# EasyEDA Pro project ProPrj_大功率电调_2026-08-17.epro, schematic 主控板

## Sheets
1 主控STM: Assembly Variant: Basic; Board Name: Board1; Create Date: 2026-08-04; Page Name: P1; Project Name: 大功率电调; Schematic Name: Schematic1; Update Date: 2026-08-04; Company: 嘉立创EDA; Page Size: A4; Version: V1.0
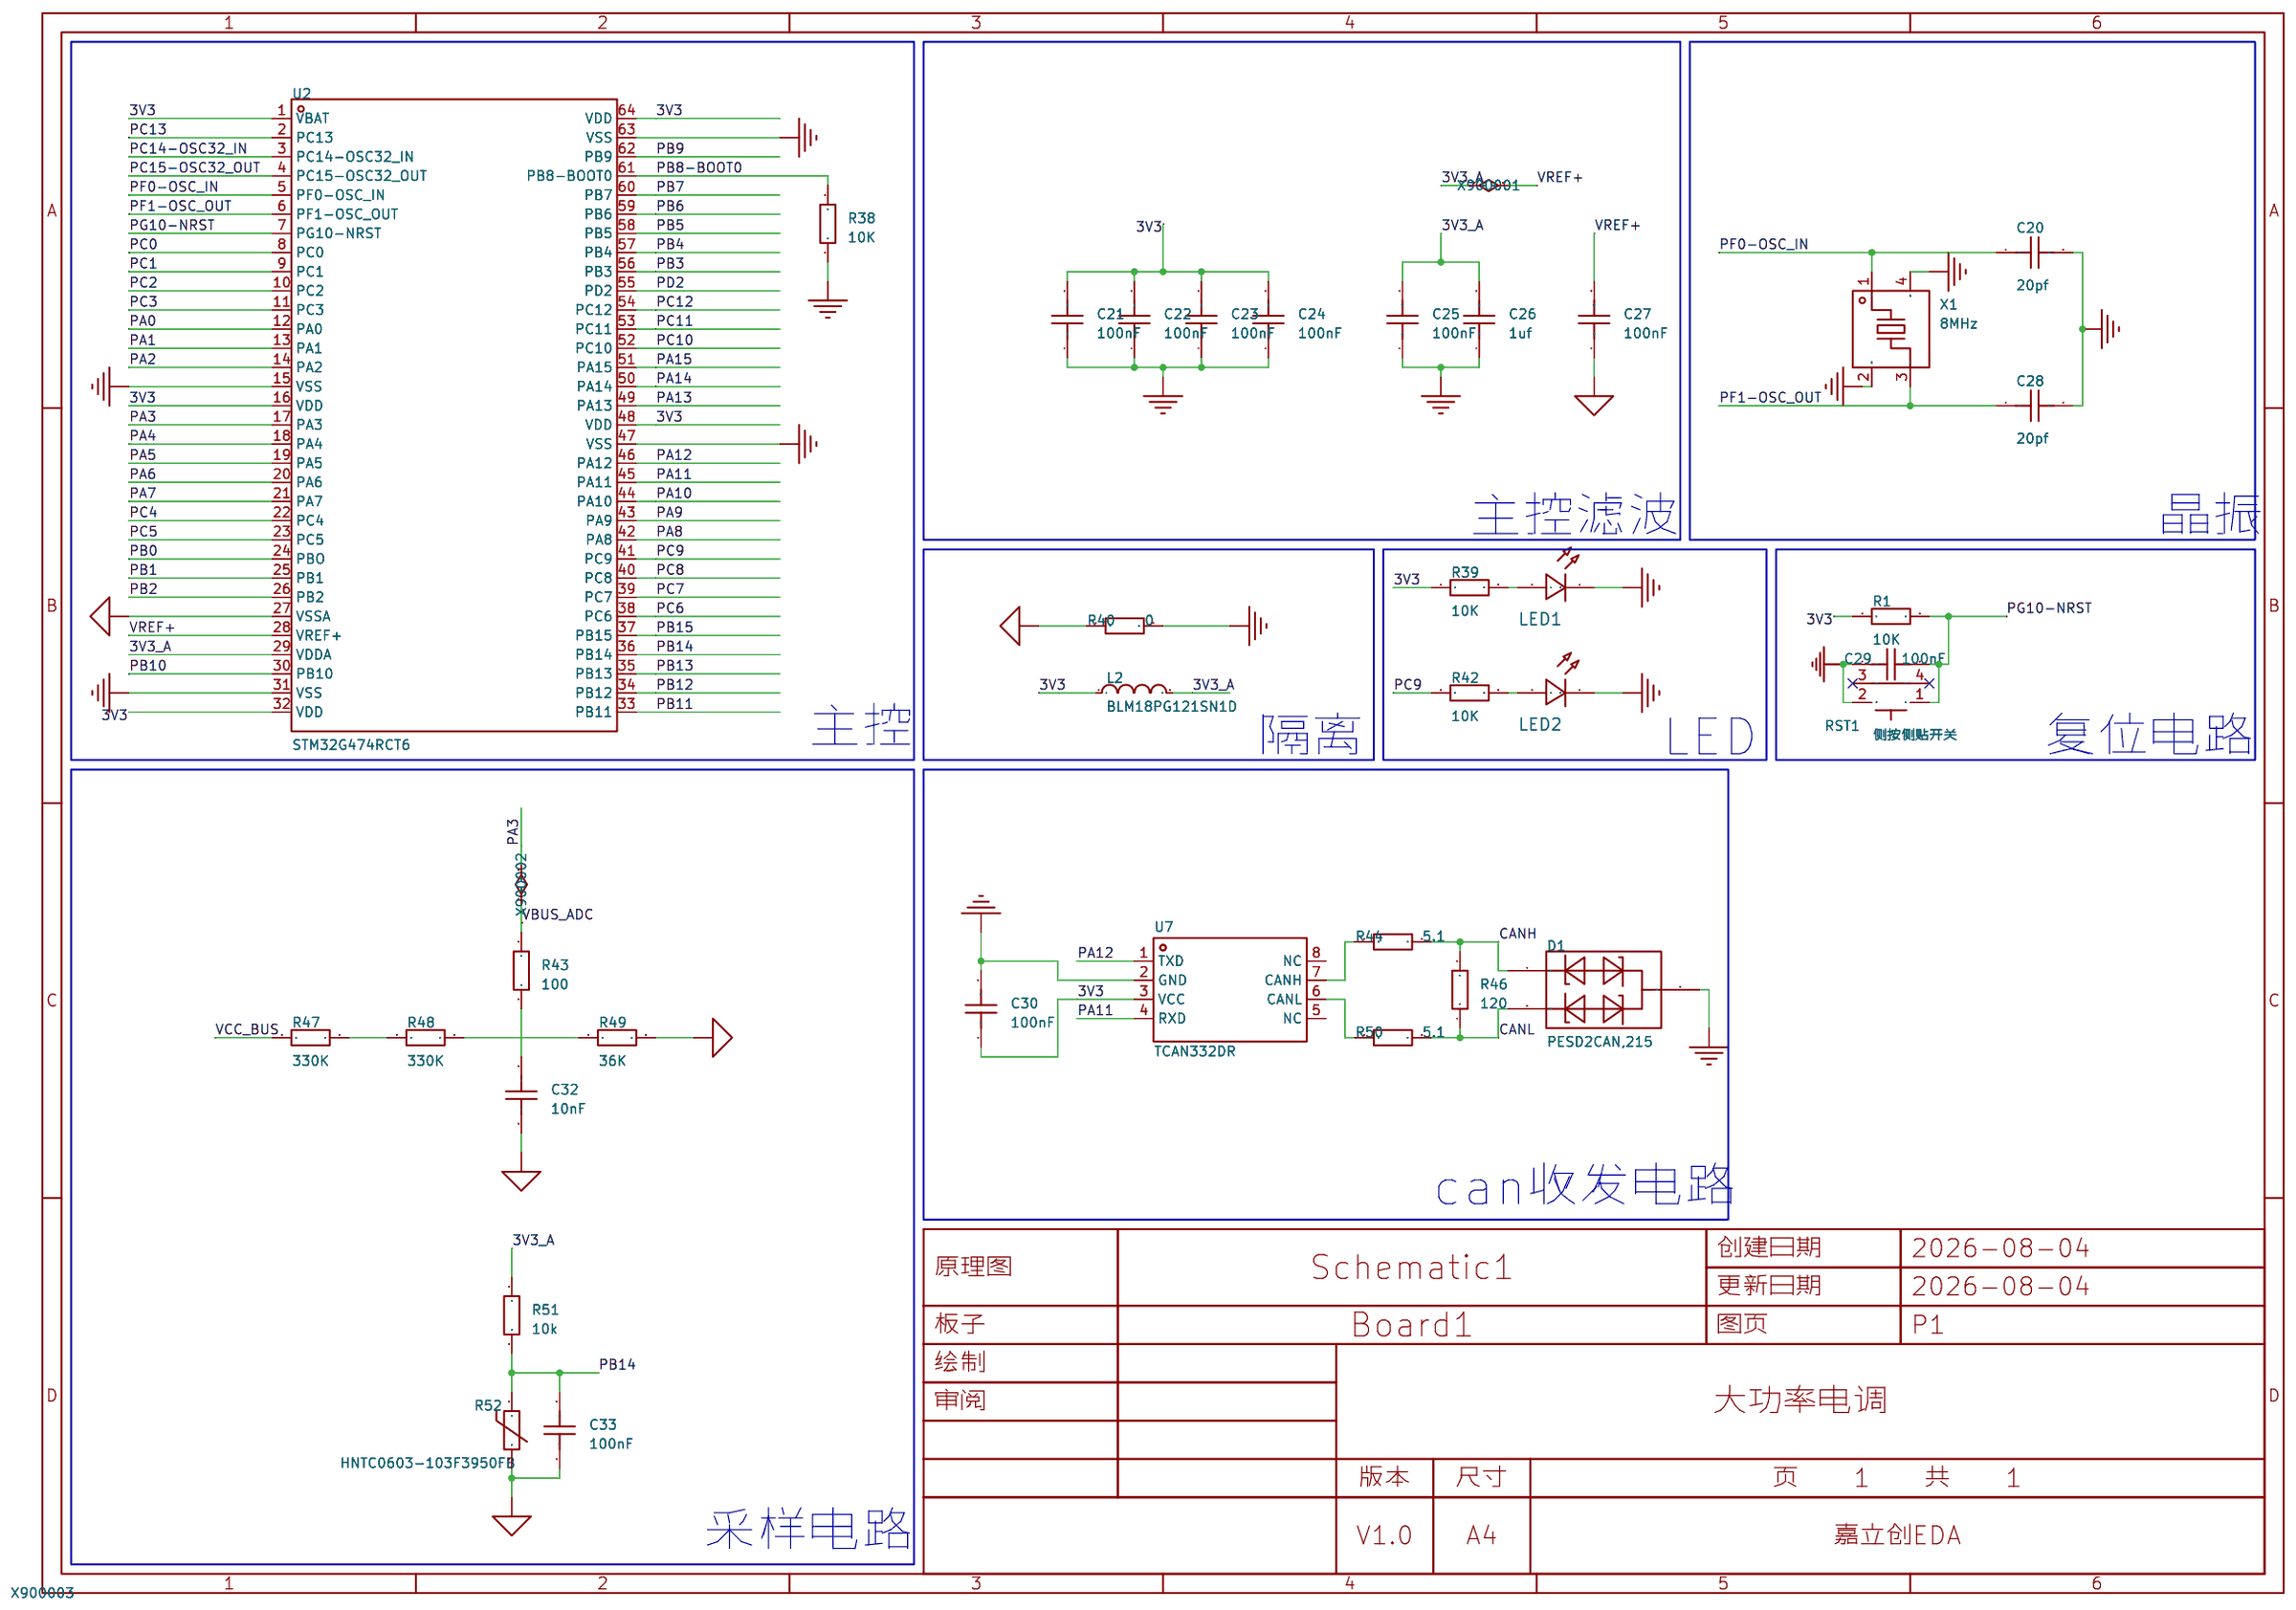
[diagram p7: 主控STM]
2 驱动: Board Name: 主控板; Page Name: P2
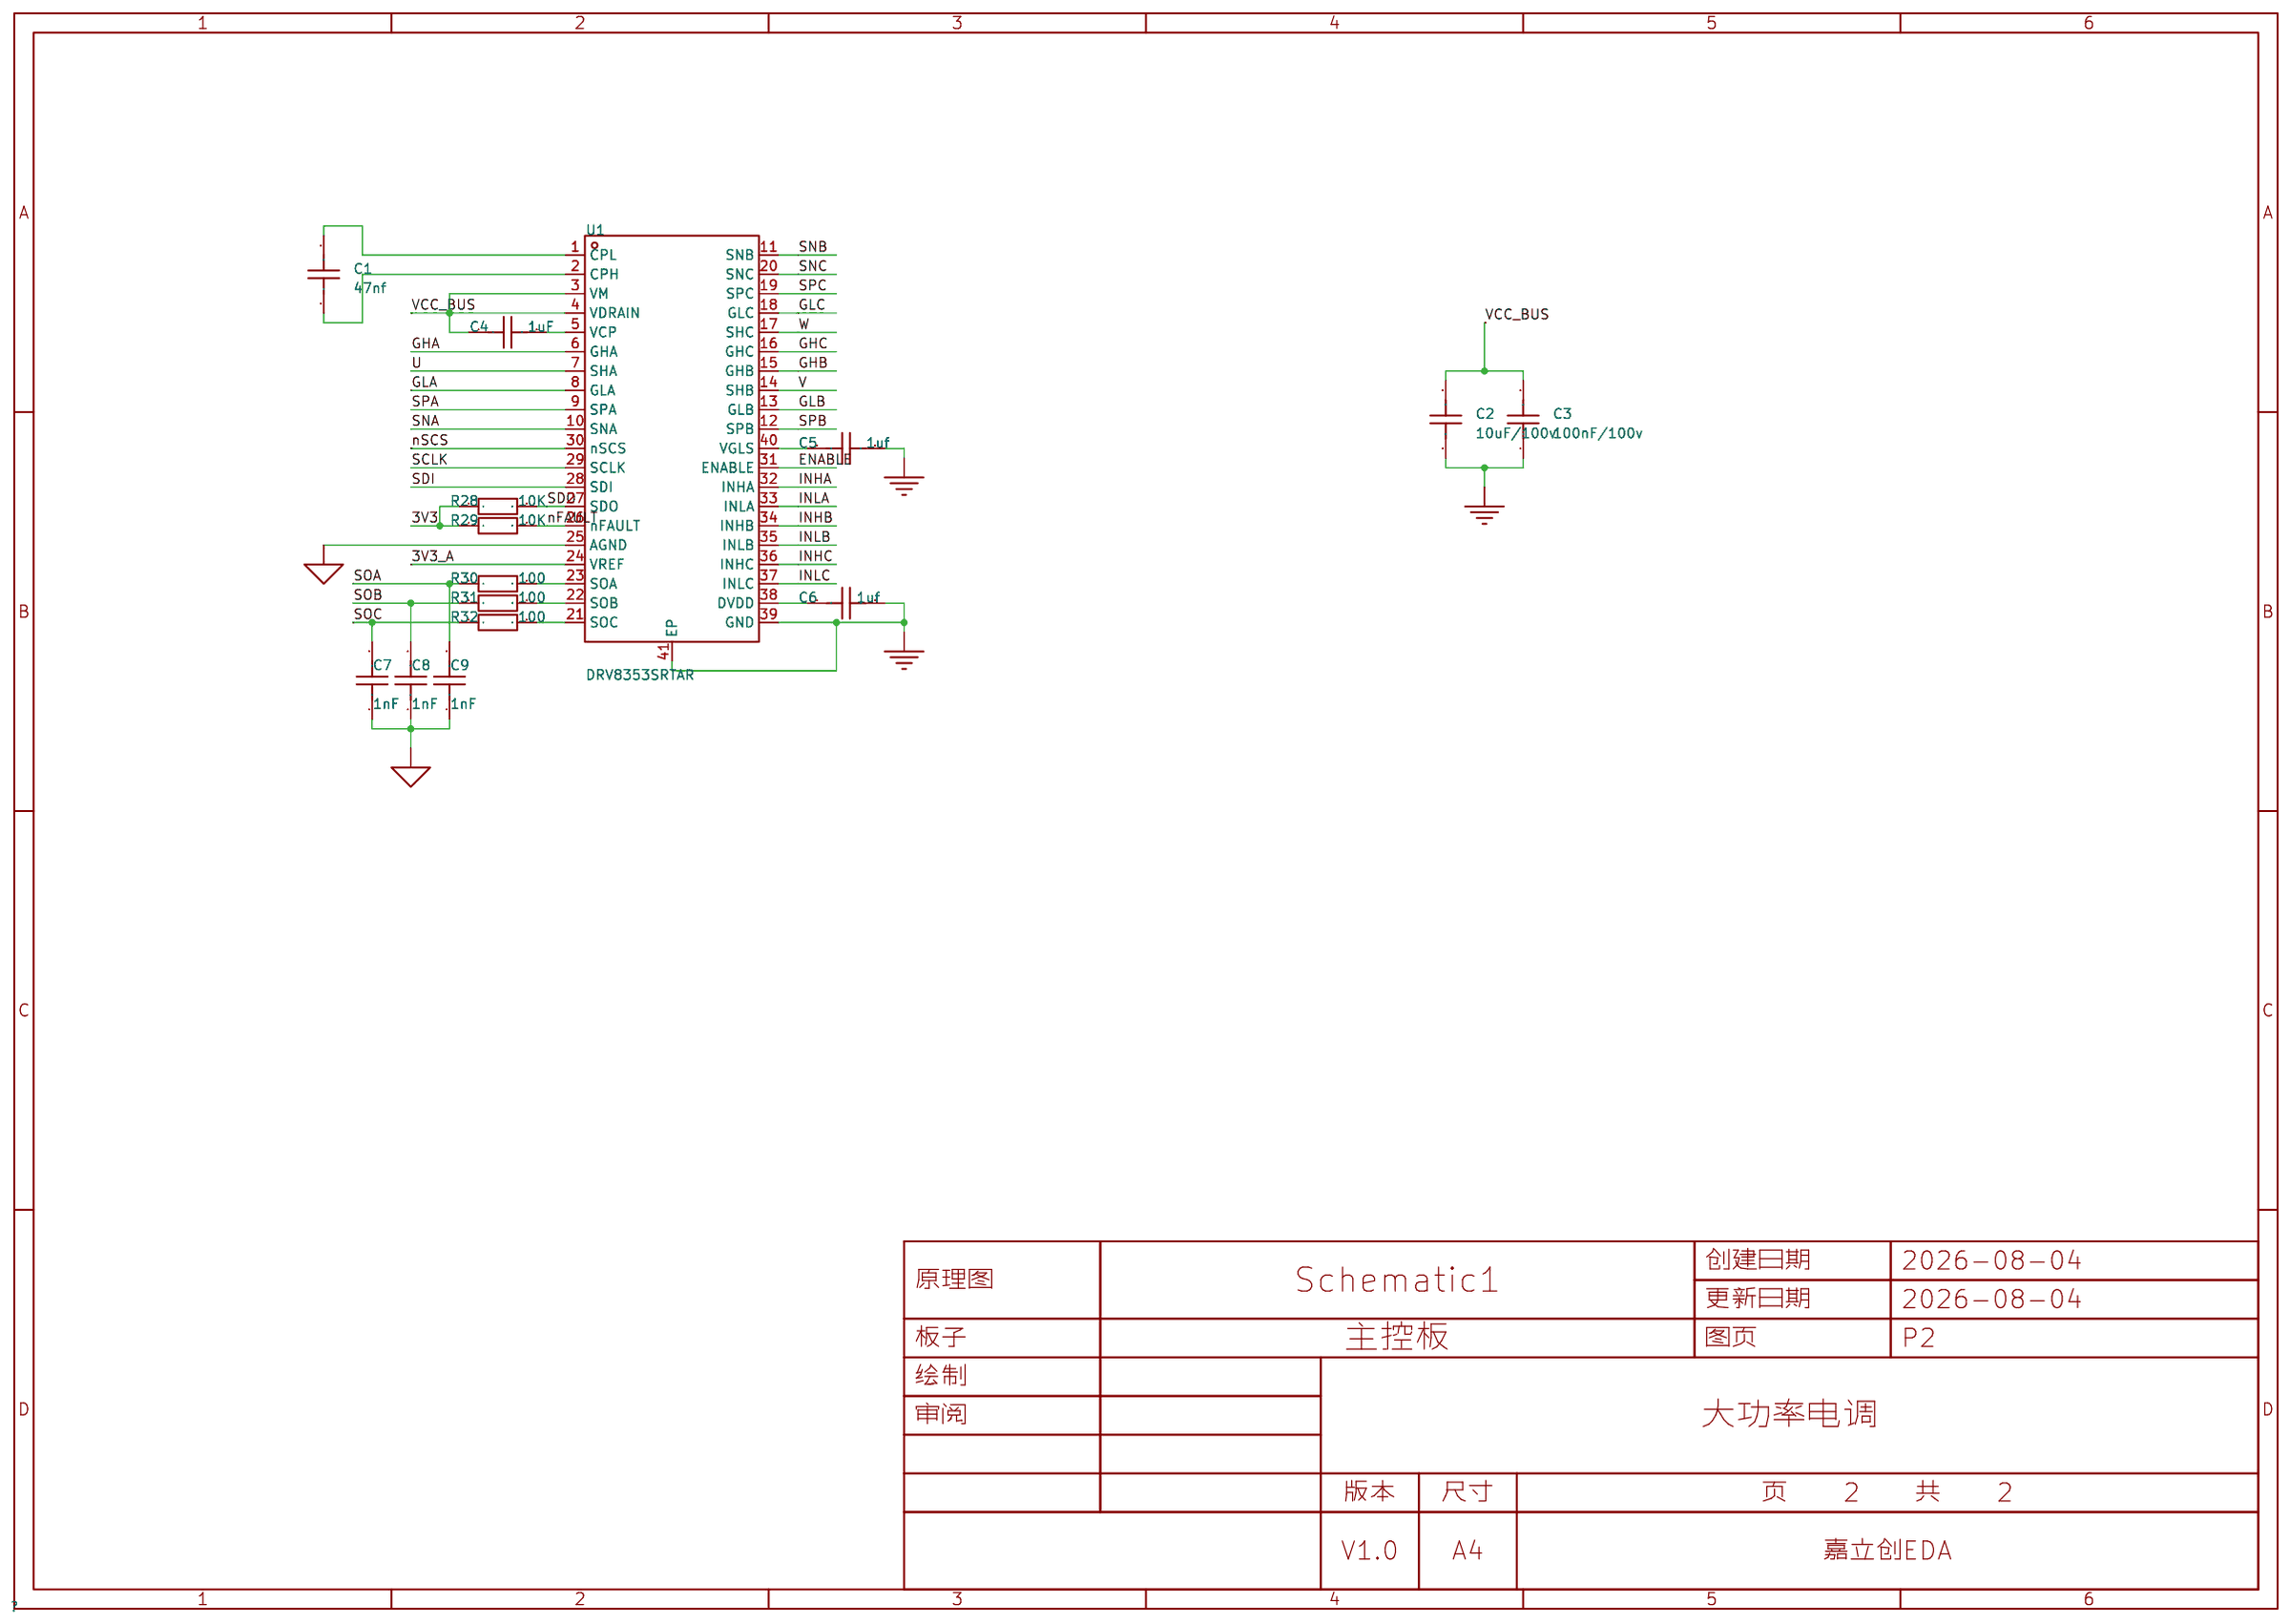
[diagram p8: 驱动]
3 电源: Board Name: 主控板
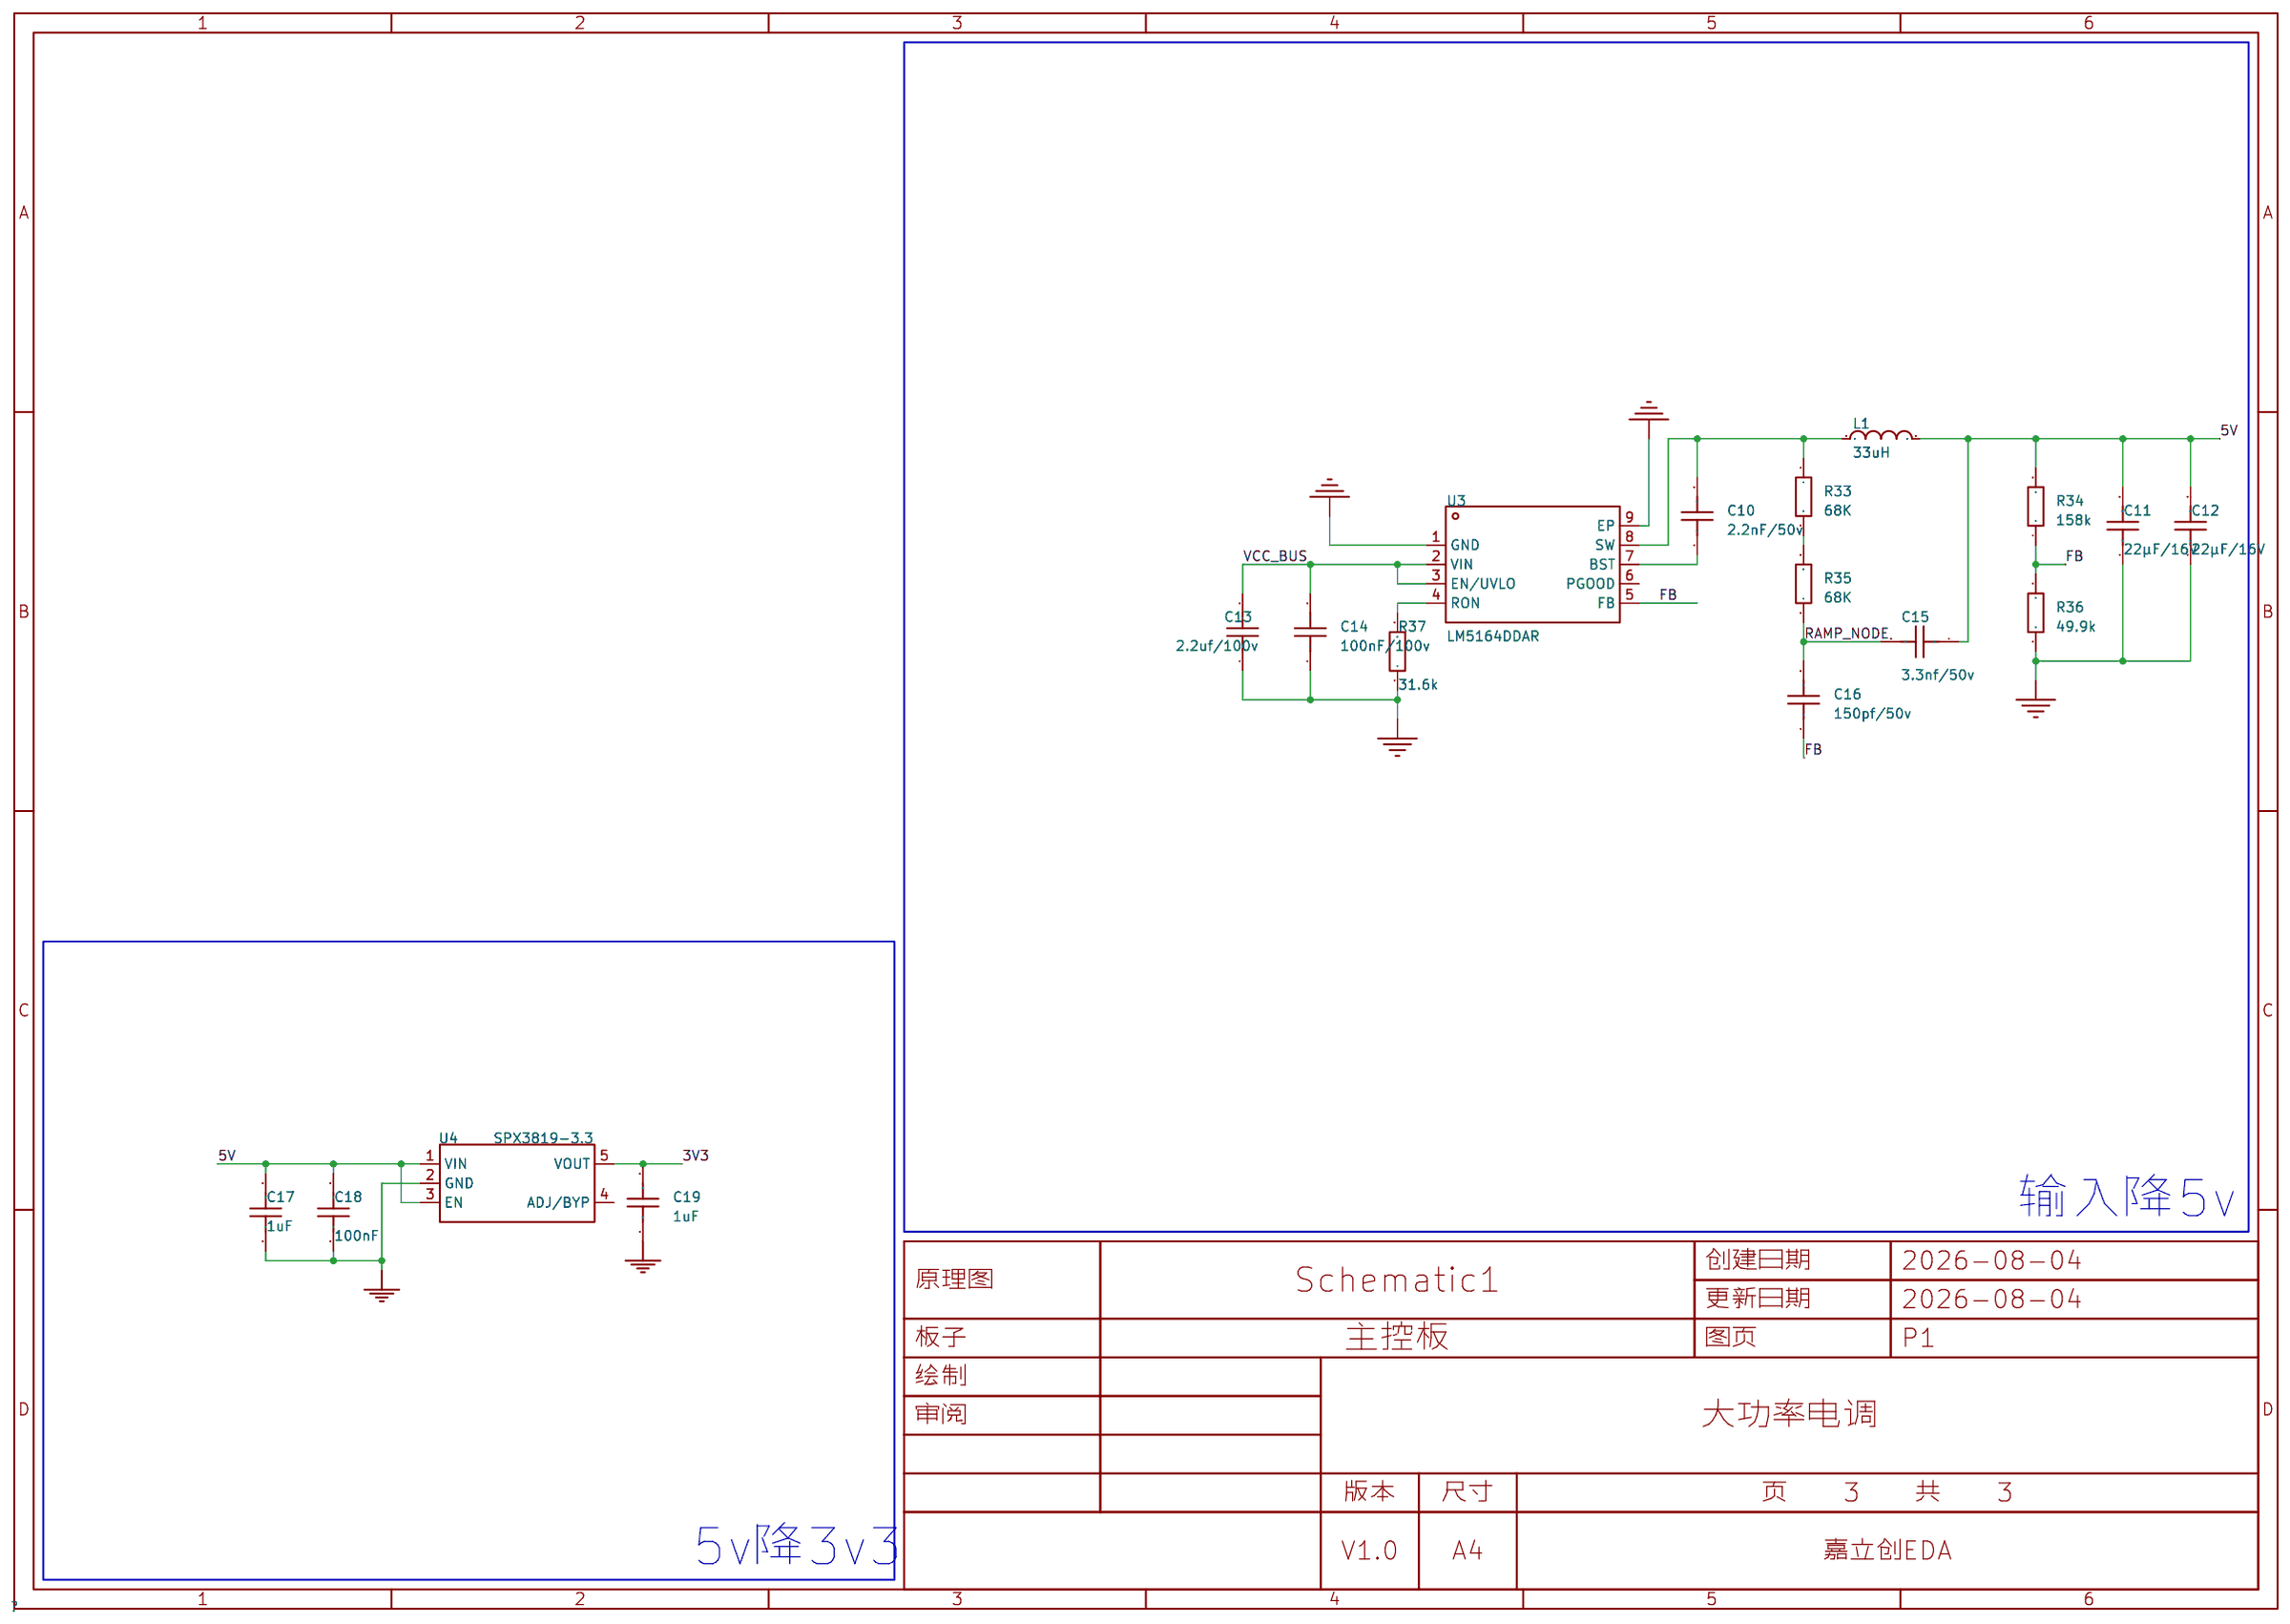
[diagram p9: 电源]

## Parts
sheet 主控STM
C20  20pf  [C0402]
C21  100nF  [C0402]
C22  100nF  [C0402]
C23  100nF  [C0402]
C24  100nF  [C0402]
C25  100nF  [C0402]
C26  1uf  [C0603]
C27  100nF  [C0402]
C28  20pf  [C0402]
C29  100nF  [C0402]
C30  100nF  [C0402]
C32  10nF  [C0603]
C33  100nF  [C0603]
D1  PESD2CAN,215  [SOT-23-3_L2.9-W1.3-P1.90-LS2.4-BR]
L2  BLM18PG121SN1D  [L0603]
LED1  -  [LED_0603]
LED2  -  [LED_0603]
R1  10K  [R0402]
R38  10K  [R0402]
R39  10K  [R0603]
R40  0  [R1206]
R42  10K  [R0603]
R43  100  [R0603]
R44  5.1  [R0603]
R46  120  [R0603]
R47  330K  [R0603]
R48  330K  [R0603]
R49  36K  [R0603]
R50  5.1  [R0603]
R51  10k  [R0603]
R52  HNTC0603-103F3950FB  [R0603]
RST1  侧按侧贴开关  [KEY-SMD_1TS003B]
U2  STM32G474RCT6  [LQFP-64_L10.0-W10.0-P0.50-LS12.0-BL]
U7  TCAN332DR  [SOIC-8_L4.9-W3.9-P1.27-LS6.0-BL]
X1  8MHz  [CRYSTAL-SMD_4P-L3.2-W2.5-BL]
sheet 电源
C10  2.2nF/50v  [C0603]
C11  22µF/16V  [C0805]
C12  22µF/16V  [C0805]
C13  2.2uf/100v  [C1206]
C14  100nF/100v  [C1206]
C15  3.3nf/50v  [C0603]
C16  150pf/50v  [C0603]
C17  1uF  [C0402]
C18  100nF  [C0402]
C19  1uF  [C0402]
L1  33uH  [IND-SMD_L5.4-W5.2]
R33  68K  [R0603]
R34  158k  [R0603]
R35  68K  [R0603]
R36  49.9k  [R0603]
R37  31.6k  [R0603]
U3  LM5164DDAR  [SO-8_L4.9-W3.9-P1.27-LS6.0-BL-EP]
U4  SPX3819-3.3  [SOT-23-5_L2.9-W1.6-P0.95-LS2.8-BL]
sheet 驱动
C1  47nf  [C0603]
C2  10uF/100v  [C1206]
C3  100nF/100v  [C1206]
C4  1uF  [C1206]
C5  1uf  [C0603]
C6  1uf  [C0603]
C7  1nF  [C0402]
C8  1nF  [C0402]
C9  1nF  [C0402]
R28  10K  [R0402]
R29  10K  [R0402]
R30  100  [R0402]
R31  100  [R0402]
R32  100  [R0402]
U1  DRV8353SRTAR  [WQFN-40_L6.0-W6.0-P0.50-TL-EP4.5]

## Library data of the parts
C7-C9 C17-C25 C27-C30 = CAP_0402: Supplier Footprint: 0402
C1 C5 C6 C10 C15 C16 C26 C32 C33 = CAP_0603: Supplier Footprint: 0603
D1 = PESD2CAN,215: 极性:双向;反向截止电压(Vrwm):24V;钳位电压:41V;峰值脉冲电流(Ipp):5A@8/20us;峰值脉冲功率(Ppp):230W@8/20us;击穿电压:28V;; LCSC Part Name: 双向ESD 24V截止 峰值脉冲电流：5A@8/20us; Supplier Part: C75176; Manufacturer: Nexperia(安世); Supplier Footprint: SOT-23; JLCPCB Part Class: Extended Part; Datasheet: https://item.szlcsc.com/datasheet/PESD2CAN%252C215/76300.html; Supplier: LCSC; Polarity: 双向; Reverse Stand-Off Voltage (Vrwm): 24V; Clamping Voltage: 41V; Peak Pulse Current (Ipp): 5A@8/20us; Peak Pulse Power Dissipation (Ppp): 230W@8/20us; Voltage - Breakdown: 28V; Reverse Leakage Current (Ir): 1nA; Number of Channels: 双路; Operating Temperature: -55℃~+150℃@(Ta); level of protection: IEC 61000-4-5；IEC 61000-4-2; Type: ESD; Junction Capacitance: 25pF
L2 = BLM18PG121SN1D: 阻抗@频率:120Ω@100MHz;误差:±25%;直流电阻(DCR):50mΩ;; LCSC Part Name: 单路 0603磁珠 阻抗120Ω@100MHz; Supplier Part: C14709; Manufacturer: muRata(村田); Supplier Footprint: 0603; JLCPCB Part Class: Basic Part; Datasheet: https://item.szlcsc.com/datasheet/BLM18PG121SN1D/15379.html; Supplier: LCSC; Impedance @ Frequency: 120Ω@100MHz; Tolerance: ±25%; DC Resistance(DCR): 50mΩ; Current Rating: 2A; Number of Circuits: 1; Operating Temperature: -55℃~+125℃
LED1 LED2 = LED_0603-R: Supplier Footprint: 0603
R1 R28-R32 R38 = Res_0402: Supplier Footprint: 0402
R33-R37 R39 R42-R44 R46-R51 = Res_0603: Supplier Footprint: 0603
R40 = Res_1206: Supplier Footprint: 1206
R52 = HNTC0603-103F3950FB: 功率:100mW;阻值:10kΩ;电阻精度:±1%;B值精度:±1%;B值(25℃/50℃):3950K;最大稳态电流(25℃):310uA;; LCSC Part Name: 贴片NTC热敏电阻; Supplier Part: C49247666; Manufacturer: R+O(宏嘉诚); Supplier Footprint: 0603; JLCPCB Part Class: Extended Part; Datasheet: https://item.szlcsc.com/datasheet/HNTC0603-103F3950FB/51678319.html; Supplier: LCSC; Power(Watts): 100mW; Resistance @ 25℃: 10kΩ; Resistance Tolerance: ±1%; B Constant Tolerance: ±1%; B Constant (25℃/50℃): 3950K; Steady State Current (Max): 310uA; Dissipation Factor: 1mW/℃; Thermal Time Constant: 5s; Operating Temperature: -40℃~+125℃; Length: 1.6mm; Width: 0.8mm; Height: 0.8mm; Pitch: 0.3mm
RST1 = 侧按侧贴开关: Supplier: LCSC; Supplier Part: C319401; Manufacturer: HYP; Manufacturer Part: 1TS003BBB-1800-3503B
U2 = STM32G474RCT6: CPU内核:ARM Cortex-M4F;CPU最大主频:170MHz;CPU位数:32 Bit;; LCSC Part Name: 带DSP和FPU的170MHz主流ARM Cortex-M4 MCU，具有256 KB Flash存储器、数学加速器、高分辨率定时器和高模拟电平集成; Supplier Part: C529414; Manufacturer: ST(意法半导体); Supplier Footprint: LQFP-64(10x10); JLCPCB Part Class: Extended Part; Datasheet: https://item.szlcsc.com/datasheet/STM32G474RCT6/549642.html; Supplier: LCSC; CPU Core: ARM Cortex-M4F; CPU Maximum Speed: 170MHz; Core Size: 32 Bit; Program Storage Size: 256KB; Program Memory Type: FLASH; RAM Size: 128KB; Number of I/O: 52; ADC (Bit): 12bit; DAC (Bit): 12bit; Oscillator Type: 内置; Voltage - Supply: 1.71V~3.6V; Operating Temperature: -40℃~+85℃
U7 = TCAN332DR: 类型:CAN收发器;数据速率:1Mbps;; LCSC Part Name: TCAN33X具备CANFD（灵活数据速率）的3.3VCAN收发器; Supplier Part: C73651; Manufacturer: TI(德州仪器); Supplier Footprint: SOIC-8; JLCPCB Part Class: Extended Part; Datasheet: https://www.ti.com/cn/lit/ds/symlink/tcan337.pdf; Supplier: LCSC; Type: CAN收发器; Data Rate: 1Mbps; Voltage - Supply: 3V~3.6V; Current - Supply: 60mA; Operating Temperature: -40℃~+125℃; Number of Channels: 1; Quiescent Supply Current: 15uA; Features: 热关断保护；欠压保护；ESD保护；TXD占优超时
X1 = X32258MSB4SI: 晶振类型:贴片晶振;频率:8MHz;常温频差:±10ppm;负载电容:20pF;频率稳定度:±20ppm;; LCSC Part Name: YSX321SL 8MHZ 4P 3225 20PF ±10PPM -40~85℃ (±20PPM); Supplier Part: C2682774; Manufacturer: YXC(扬兴晶振); Supplier Footprint: SMD3225-4P; JLCPCB Part Class: Extended Part; Datasheet: https://item.szlcsc.com/datasheet/X32258MSB4SI/2777871.html; Supplier: LCSC; Type: 贴片晶振; Normal temperature Frequency Tolerance: ±10ppm; Load Capacitance: 20pF; Frequency Stability: ±20ppm; Operating Temperature: -40℃~+85℃
C11 C12 = CAP_0805: Supplier Footprint: 0805
C2-C4 C13 C14 = CAP_1206: Supplier Footprint: 1206
L1 = ZEMS0530-330M: 电感值:33uH;精度:±20%;额定电流:1.2A;饱和电流(Isat):2A;类型:一体成型电感;; LCSC Part Name: 33uH ±20% 2A; Supplier Part: C41413117; Manufacturer: ZE(增益); Supplier Footprint: SMD,5.4x5.2mm; JLCPCB Part Class: Extended Part; Datasheet: https://item.szlcsc.com/datasheet/ZEMS0530-330M/43227580.html; Supplier: LCSC; Tolerance: ±20%; Current Rating: 1.2A; Current - Saturation(Isat): 2A; DC Resistance(DCR): 395mΩ; Type: 一体成型电感
U3 = LM5164DDAR: 功能类型:降压型;工作电压:6V~100V;输出电压:-;输出电流:1A;输出类型:可调;; LCSC Part Name: 降压型 1A 6V~100V; Supplier Part: C477928; Manufacturer: TI(德州仪器); Supplier Footprint: SO-8-EP; JLCPCB Part Class: Extended Part; Datasheet: https://www.ti.com/cn/lit/ds/symlink/lm5164.pdf; Supplier: LCSC; Function: 降压型; Voltage - Supply: 6V~100V; Output Current: 1A; Frequency - Switching: 1MHz; Operating Temperature: -40℃~+150℃@(TJ); Synchronous Rectifier: 是; Number of Outputs: 1; Topology: 降压式; Quiescent Current: 10.5uA; Switch tube (built-in/external): 内置; Output Type: 可调; Features: 轻载高效模式；内置LDO稳压器；逐波限流；过流保护；工作状态指示
U4 = SPX3819-3.3: Supplier: LCSC; Supplier Part: C9900018941; Manufacturer: null; Manufacturer Part: SPX3819M5-3.3; JLCPCB Part Class: Extended Part
U1 = DRV8353SRTAR: 驱动配置:三相;负载类型:MOSFET;驱动通道数:6;灌电流(IOL):2A;拉电流(IOH):1A;工作电压:9V~75V;上升时间(tr):-;下降时间(tf):-;; LCSC Part Name: 100V三相智能栅极驱动器; Supplier Part: C701785; Manufacturer: TI(德州仪器); Supplier Footprint: WQFN-40-EP(6x6); JLCPCB Part Class: Extended Part; Datasheet: https://www.ti.com/cn/lit/ds/symlink/drv8353.pdf; Supplier: LCSC; Driven Configuration: 三相; Load Type: MOSFET; Number of Drivers: 6; Current - Output Low(IOL): 2A; Current - Output High(IOH): 1A; Voltage - Supply: 9V~75V; Features: 使能关断；交错导通保护；死区时间控制；充电泵升压; Operating Temperature: -40℃~+125℃; Input Logic Level - High: 1.5V; Input Logic Level - Low: 800mV; Quiescent Current(Iq): 20uA

## Nets
3V3: C19.2 C21.2 C22.2 C23.2 C24.2 C30.1 L2.1 R1.1 R28.1 R29.1 R39.1 U2.1(VBAT) U2.16(VDD) U2.32(VDD) U2.48(VDD) U2.64(VDD) U4.5(VOUT) U7.3(VCC)
3V3_A: C25.2 C26.2 C27.2 L2.2 R51.1 U1.24(VREF) U2.28(VREF+) U2.29(VDDA)
5V: C11.2 C12.2 C15.1 C17.2 C18.2 L1.2 R34.2 U4.1(VIN) U4.3(EN)
AGND: C7.1 C8.1 C9.1 C27.1 C32.1 C33.1 R40.1 R49.2 R52.2 U1.25(AGND) U2.27(VSSA)
GND: C2.1 C3.1 C5.2 C6.2 C11.1 C12.1 C13.1 C14.1 C17.1 C18.1 C19.1 C20.2 C21.1 C22.1 C23.1 C24.1 C25.1 C26.1 C28.2 C29.1 C30.2 D1.3 LED1.1(C) LED2.1(C) R36.1 R37.1 R38.1 R40.2 RST1.2 U1.39(GND) U1.41(EP) U2.15(VSS) U2.31(VSS) U2.47(VSS) U2.63(VSS) U3.1(GND) U3.9(EP) U4.2(GND) U7.2(GND) X1.2(GND) X1.4(GND)
VCC_BUS: C2.2 C3.2 C4.1 C13.2 C14.2 R47.1 U1.3(VM) U1.4(VDRAIN) U3.2(VIN) U3.3(EN/UVLO)
CANH: D1.1 R44.2 R46.2
CANL: D1.2 R46.1 R50.2
ENABLE: U1.31(ENABLE)
FB: C16.1 R34.1 R36.2 U3.5(FB)
GHA: U1.6(GHA)
GHB: U1.15(GHB)
GHC: U1.16(GHC)
GLA: U1.8(GLA)
GLB: U1.13(GLB)
GLC: U1.18(GLC)
INHA: U1.32(INHA)
INHB: U1.34(INHB)
INHC: U1.36(INHC)
INLA: U1.33(INLA)
INLB: U1.35(INLB)
INLC: U1.37(INLC)
nFAULT: R29.2 U1.26(nFAULT)
nSCS: U1.30(nSCS)
PA0: U2.12(PA0)
PA1: U2.13(PA1)
PA2: U2.14(PA2)
PA3: R43.2 U2.17(PA3)
PA4: U2.18(PA4)
PA5: U2.19(PA5)
PA6: U2.20(PA6)
PA7: U2.21(PA7)
PA8: U2.42(PA8)
PA9: U2.43(PA9)
PA10: U2.44(PA10)
PA11: U2.45(PA11) U7.4(RXD)
PA12: U2.46(PA12) U7.1(TXD)
PA13: U2.49(PA13)
PA14: U2.50(PA14)
PA15: U2.51(PA15)
PB0: U2.24(PBO)
PB1: U2.25(PB1)
PB2: U2.26(PB2)
PB3: U2.56(PB3)
PB4: U2.57(PB4)
PB5: U2.58(PB5)
PB6: U2.59(PB6)
PB7: U2.60(PB7)
PB8-BOOT0: R38.2 U2.61(PB8-BOOT0)
PB9: U2.62(PB9)
PB10: U2.30(PB10)
PB11: U2.33(PB11)
PB12: U2.34(PB12)
PB13: U2.35(PB13)
PB14: C33.2 R51.2 R52.1 U2.36(PB14)
PB15: U2.37(PB15)
PC0: U2.8(PC0)
PC1: U2.9(PC1)
PC2: U2.10(PC2)
PC3: U2.11(PC3)
PC4: U2.22(PC4)
PC5: U2.23(PC5)
PC6: U2.38(PC6)
PC7: U2.39(PC7)
PC8: U2.40(PC8)
PC9: R42.1 U2.41(PC9)
PC10: U2.52(PC10)
PC11: U2.53(PC11)
PC12: U2.54(PC12)
PC13: U2.2(PC13)
PC14-OSC32_IN: U2.3(PC14-OSC32_IN)
PC15-OSC32_OUT: U2.4(PC15-OSC32_OUT)
PD2: U2.55(PD2)
PF0-OSC_IN: C20.1 U2.5(PF0-OSC_IN) X1.1
PF1-OSC_OUT: C28.1 U2.6(PF1-OSC_OUT) X1.3
PG10-NRST: C29.2 R1.2 RST1.1 U2.7(PG10-NRST)
RAMP_NODE: C15.2 C16.2 R35.1
SCLK: U1.29(SCLK)
SDI: U1.28(SDI)
SDO: R28.2 U1.27(SDO)
SNA: U1.10(SNA)
SNB: U1.11(SNB)
SNC: U1.20(SNC)
SOA: C9.2 R30.1
SOB: C8.2 R31.1
SOC: C7.2 R32.1
SPA: U1.9(SPA)
SPB: U1.12(SPB)
SPC: U1.19(SPC)
U: U1.7(SHA)
V: U1.14(SHB)
W: U1.17(SHC)
$1N4: LED2.2(A) R42.2
$1N5: LED1.2(A) R39.2
$1N19: R44.1 U7.7(CANH)
$1N20: R50.1 U7.6(CANL)
$1N26: C32.2 R43.1 R48.2 R49.1
$1N27: R47.2 R48.1
$2N6: C6.1 U1.38(DVDD)
$2N8: C5.1 U1.40(VGLS)
$2N26: R32.2 U1.21(SOC)
$2N27: R31.2 U1.22(SOB)
$2N28: R30.2 U1.23(SOA)
$2N30: C4.2 U1.5(VCP)
$2N42: C1.1 U1.2(CPH)
$2N43: C1.2 U1.1(CPL)
$3N3: R33.2 R35.2
$3N8: C10.2 L1.1 R33.1 U3.8(SW)
$3N9: C10.1 U3.7(BST)
$3N14: R37.2 U3.4(RON)

Not connected (* = marked no-connect by the designer): RST1 3* 4*; U3 6(PGOOD); U4 4(ADJ/BYP); U7 5(NC) 8(NC)

## Notes on the sheets
sheet 1
- 主控滤波
- 晶振
- 主控
- 隔离
- LED
- 复位电路
- can收发电路
- 采样电路
sheet 3
- 输入降5v
- 5v降3v3
